# Altium project MC60_PCB_V1.PrjPcb
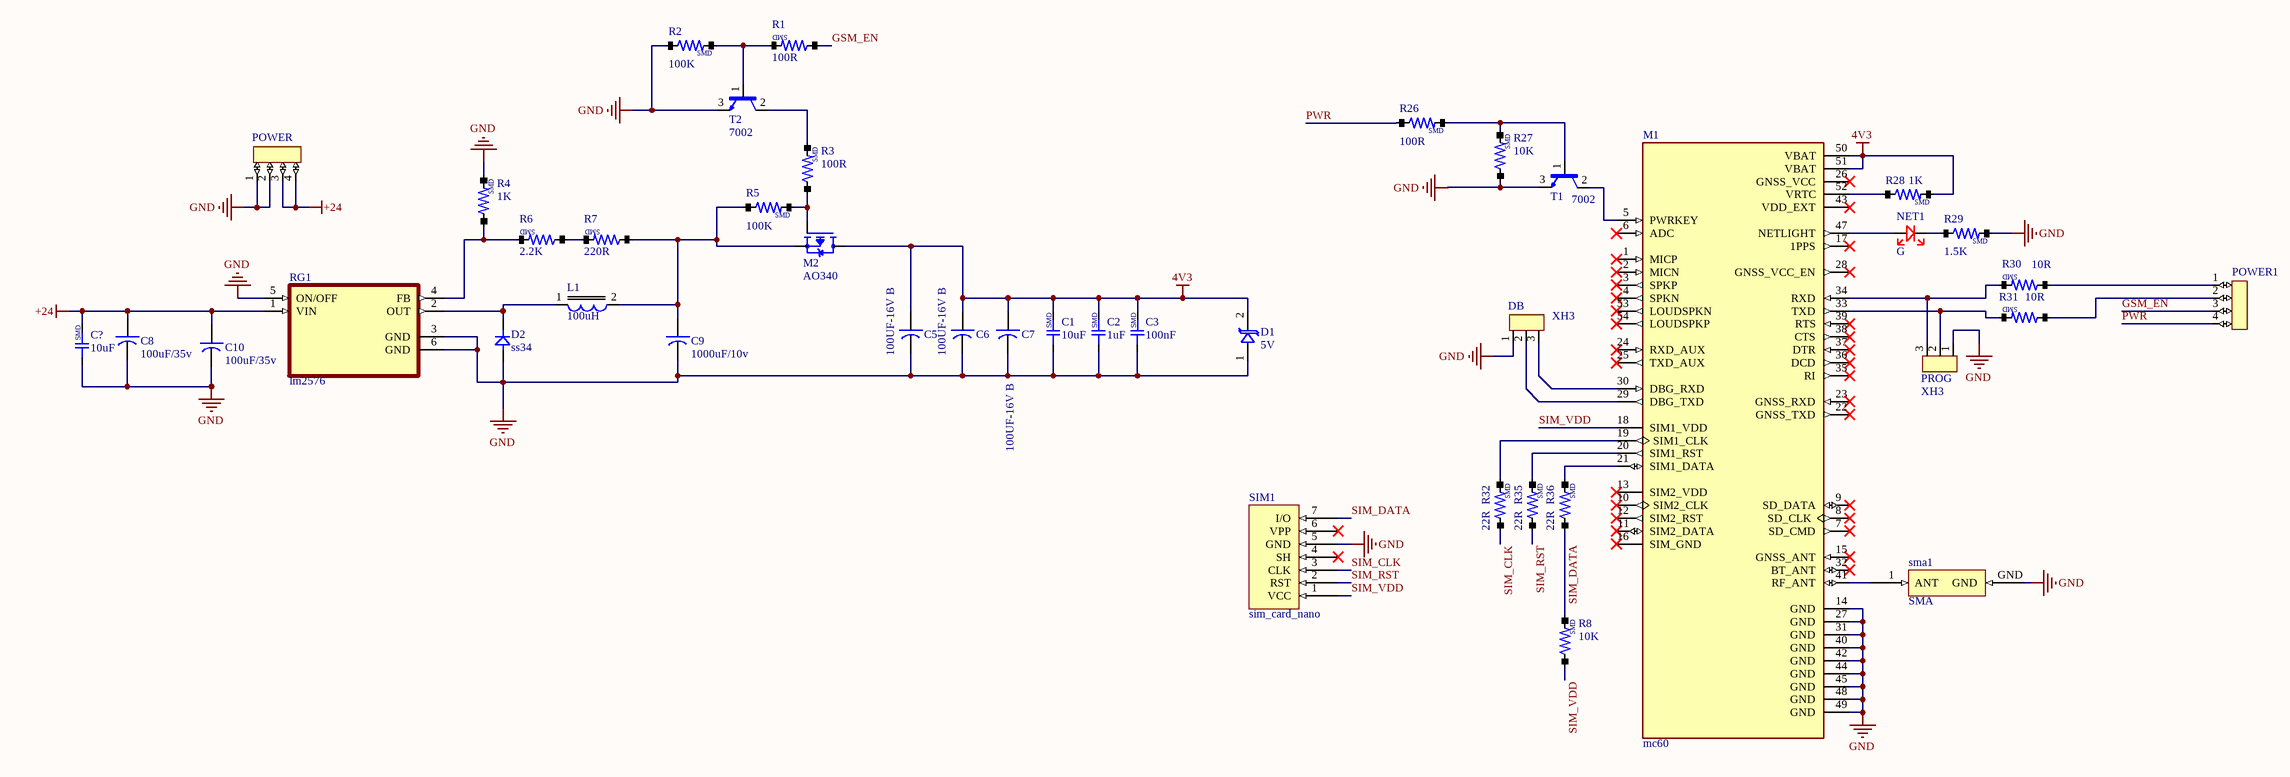
[diagram p0: GSM.SchDoc]
1 sheet, 42 parts. Net scope: global (net labels, ports and power ports of the same name join across sheets).
Board file: MC60_PCB_V1.PcbDoc

## Sheet GSM.SchDoc
size 635 x 254 mm; SheetNumber: 7; SheetTotal: 7

### Parts
C1  10uF  [CAP-0603]
C2  1uF  [CAP-0603]
C3  100nF  [CAP-0603]
C5  100UF-16V B  [CAP_TANTAL_B]
C6  100UF-16V B  [CAP_TANTAL_B]
C7  100UF-16V B  [CAP_TANTAL_B]
C8  100uF/35v  [CAP-EL-P3.5MM]
C9  1000uF/10v  [CAP-EL-P3.5MM]
C10  100uF/35v  [CAP-EL-P3.5MM]
C?  10uF  [CAP-1206]
D1  5V  [TVS-5V-SMD]
D2  ss34  [DIOD/1N4007/SMD]
DB  XH3  [XH3]
L1  100uH  [100UH-101M]
M1  mc60  [MC60]
M2  AO340  [AO3401A]
NET1  G  [LED/0805]
POWER  (no value)  [CONECTOR/XH/4PIN]
POWER1  (no value)  [CONECTOR/XH/4PIN]
PROG  XH3  [XH3]
R1  100R  [RES/0603]
R2  100K  [RES/0603]
R3  100R  [RES/0603]
R4  1K  [RES/0603]
R5  100K  [RES/0603]
R6  2.2K  [RES/0603]
R7  220R  [RES/0603]
R8  10K  [RES/0603]
R26  100R  [RES/0603]
R27  10K  [RES/0603]
R28  1K  [RES/0603]
R29  1.5K  [RES/0603]
R30  10R  [RES/0603]
R31  10R  [RES/0603]
R32  22R  [RES/0603]
R35  22R  [RES/0603]
R36  22R  [RES/0603]
RG1  lm2576  [lm2576]
SIM1  sim_card_nano  [sim_card_nano]
sma1  SMA  [SMA]
T1  7002  [SOT23]
T2  7002  [SOT23]

### Nets
4V3: C1.2 C2.2 C3.2 C5.+ C6.+ C7.+ D1.2 M1.50(VBAT) M1.51(VBAT) M2.D R28.2
+24: C8.+ C10.+ C?.2 POWER.3 POWER.4 RG1.1(VIN)
GND: C1.1 C2.1 C3.1 C5.- C6.- C7.- C8.- C9.- C10.- C?.1 D1.1 D2.A DB.1 M1.14(GND) M1.27(GND) M1.31(GND) M1.40(GND) M1.42(GND) M1.44(GND) M1.45(GND) M1.48(GND) M1.49(GND) POWER.1 POWER.2 PROG.1 R2.1 R4.2 R27.1 R29.2 RG1.3(GND) RG1.5(ON/OFF) RG1.6(GND) SIM1.5(GND) sma1.GND T1.3(E) T2.3(E)
GSM_EN: POWER1.3 R1.1
PWR: POWER1.4 R26.1
SIM_CLK: R32.1 SIM1.3(CLK)
SIM_DATA: R8.2 R36.1 SIM1.7(I/O)
SIM_RST: R35.1 SIM1.2(RST)
SIM_VDD: M1.18(SIM1_VDD) R8.1 SIM1.1(VCC)
NetC9_+: C9.+ L1.2 M2.S R5.1 R7.1
NetD2_K: D2.K L1.1 RG1.2(OUT)
NetDB_2: DB.2 M1.29(DBG_TXD)
NetDB_3: DB.3 M1.30(DBG_RXD)
NetM1_5: M1.5(PWRKEY) T1.2(C)
NetM1_19: M1.19(SIM1_CLK) R32.2
NetM1_20: M1.20(SIM1_RST) R35.2
NetM1_21: M1.21(SIM1_DATA) R36.2
NetM1_33: M1.33(TXD) PROG.2 R31.2
NetM1_34: M1.34(RXD) PROG.3 R30.2
NetM1_41: M1.41(RF_ANT) sma1.1(ANT)
NetM1_47: M1.47(NETLIGHT) NET1.A
NetM1_52: M1.52(VRTC) R28.1
NetM2_G: M2.G R3.1 R5.2
NetNET1_K: NET1.K R29.1
NetPOWER1_1: POWER1.1 R30.1
NetPOWER1_2: POWER1.2 R31.1
NetR1_2: R1.2 R2.2 T2.1(B)
NetR3_2: R3.2 T2.2(C)
NetR4_1: R4.1 R6.2 RG1.4(FB)
NetR6_1: R6.1 R7.2
NetR26_2: R26.2 R27.2 T1.1(B)

Not connected (* = marked no-connect by the designer): M1 1(MICP)* 2(MICN)* 3(SPKP)* 4(SPKN)* 6(ADC)* 7(SD_CMD)* 8(SD_CLK)* 9(SD_DATA)* 10(SIM2_CLK)* 11(SIM2_DATA)* 12(SIM2_RST)* 13(SIM2_VDD)* 15(GNSS_ANT)* 16(SIM_GND)* 17(1PPS)* 22(GNSS_TXD)* 23(GNSS_RXD)* 24(RXD_AUX)* 25(TXD_AUX)* 26(GNSS_VCC)* 28(GNSS_VCC_EN)* 32(BT_ANT)* 35(RI)* 36(DCD)* 37(DTR)* 38(CTS)* 39(RTS)* 43(VDD_EXT)* 53(LOUDSPKN)* 54(LOUDSPKP)*; SIM1 4(SH)* 6(VPP)*

### Notes on the sheet
- (in symbol cap_smd) SMD
- (in symbol RES/SMD) SMD

### Library data of the parts
C1-C3 C? = cap_smd
C5-C10 = cap-electrolit
D1 = TVS-SMD
D2 = DIOD/RECTIFIERS
L1 = inductor
M2 = MOSFET_P_CH
NET1 = LED
POWER POWER1 = CONECTOR/XH/4PIN
R1-R8 R26-R32 R35 R36 = RES/SMD
T1 T2 = NPN